# EAGLE design Anti thept2ENGINE -V2 (2) (EAGLE 7.6.0)
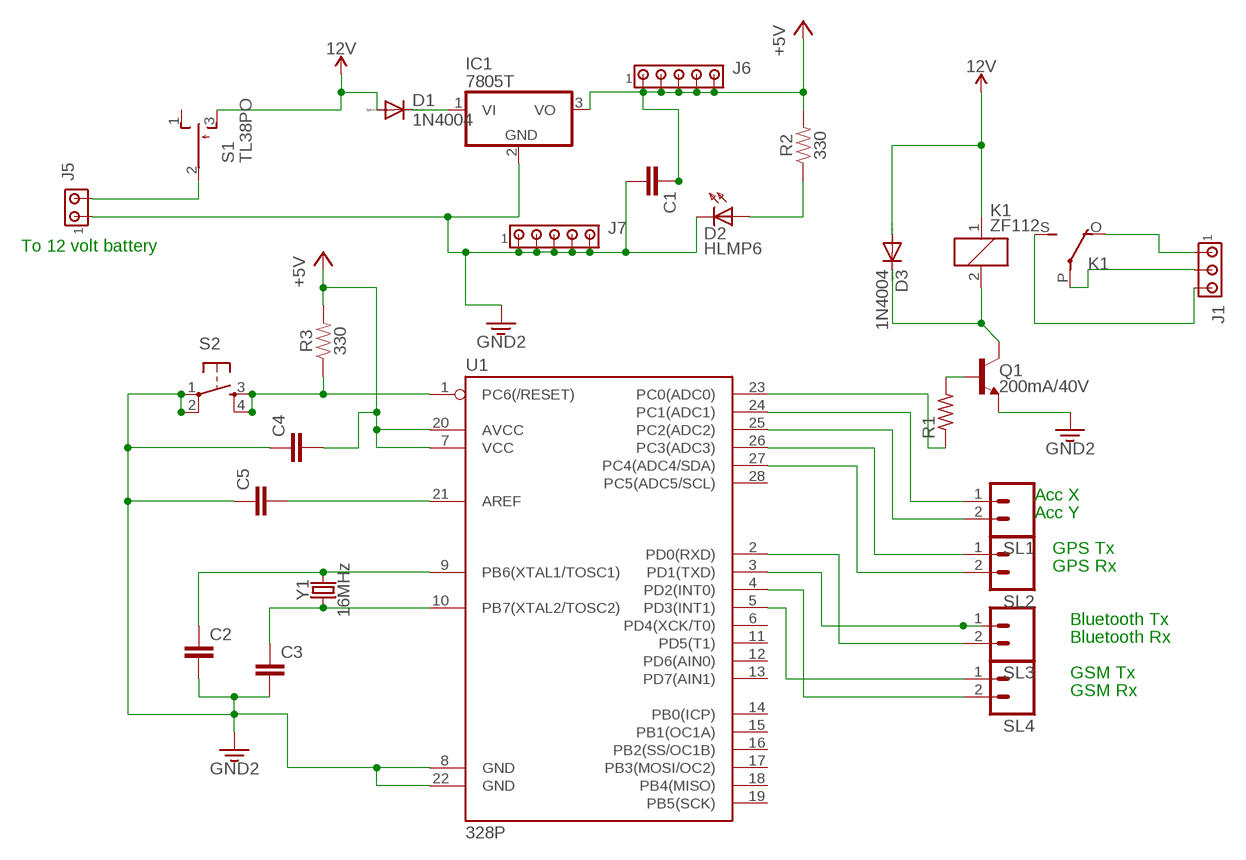
[diagram p0: schematic, sheet 1]

## Parts
C1  C5/2.5  [C5B2.5]
C2  C5/2.5  [C5B2.5]
C3  C5/2.5  [C5B2.5]
C4  C5/2.5  [C5B2.5]
C5  C5/2.5  [C5B2.5]
D1  1N4004  [DO41-10]
D2  HLMP6  [HLMP6]
D3  1N4004  [DO41-10]
IC1  7805T  [TO220H]
J1  MTA03-156  [1X3MTA]
J5  MTA02-156  [1X2MTA]
J6  MTA05-100  [10X05MTA]
J7  MTA05-100  [10X05MTA]
K1  ZF112  [ZF112]
Q1  200mA/40V  TRANS_NPN-2N3904  [TO-92]
R1  R-US_0204/7  [0204/7]
R2  330  330OHM-HORIZ-1/10W-5%  [AXIAL-0.3]
R3  330  330OHM-HORIZ-1/10W-5%  [AXIAL-0.3]
S1  TL38PO  [TL3XPO]
S2  TAC_SWITCHPTH  [TACTILE-PTH]
SL1  MA02  [02PA]
SL2  MA02  [02PA]
SL3  MA02  [02PA]
SL4  MA02  [02PA]
U1  328P  ATMEGA328P_PDIP  [DIP28]
Y1  16MHz  CRYSTAL-16MHZPTH-HC49US  [HC49US]

## Nets
3.3V: C1.2 C2.2 C3.2 C4.1 C5.1 D2.K IC1.2(GND) J5.1 J7.1 J7.2 J7.3 J7.4 J7.5 Q1.1(E) S2.1 S2.2 U1.8(GND) U1.22(GND) ; supply symbol labelled GND2
12V: D1.A D3.A K1.1 S1.3(S)
+5V: C1.1 C4.2 IC1.3(VO) J6.1 J6.2 J6.3 J6.4 J6.5 R2.P$2 R3.P$2 U1.7(VCC) U1.20(AVCC)
N$1: J1.1 K1.O(2:O)
N$2: J1.2 K1.P(2:P)
N$3: Q1.2(B) R1.2
N$4: D3.C K1.2 Q1.3(C)
N$5: J1.3 K1.S(2:S)
N$6: R1.1 U1.23(PC0(ADC0))
N$7: D2.A R2.P$1
N$8: C3.1 U1.10(PB7(XTAL2/TOSC2)) Y1.1
N$9: SL1.1 U1.24(PC1(ADC1))
N$10: R3.P$1 S2.3 S2.4 U1.1(PC6(/RESET))
N$11: SL1.2 U1.25(PC2(ADC2))
N$12: C5.2 U1.21(AREF)
N$13: SL2.1 U1.26(PC3(ADC3))
N$14: J5.2 S1.2(P)
N$15: SL3.2 U1.2(PD0(RXD))
N$16: D1.C IC1.1(VI)
N$17: SL3.1 U1.3(PD1(TXD))
N$18: C2.1 U1.9(PB6(XTAL1/TOSC1)) Y1.2
N$19: SL2.2 U1.27(PC4(ADC4/SDA))
N$20: SL4.2 U1.4(PD2(INT0))
N$21: SL4.1 U1.5(PD3(INT1))
Unconnected: S1.1(O) U1.6(PD4(XCK/T0)) U1.11(PD5(T1)) U1.12(PD6(AIN0)) U1.13(PD7(AIN1)) U1.14(PB0(ICP)) U1.15(PB1(OC1A)) U1.16(PB2(SS/OC1B)) U1.17(PB3(MOSI/OC2)) U1.18(PB4(MISO)) U1.19(PB5(SCK)) U1.28(PC5(ADC5/SCL))

## Notes on the sheet
- To 12 volt battery
- Acc X
- Acc Y
- GPS Tx
- GPS Rx
- Bluetooth Tx
- Bluetooth Rx
- GSM Tx
- GSM Rx

## Library data of the parts
C1-C5 = capacitor-wima:C: CAPACITOR naming: grid - package width
D1 D3 = diode:1N4004: DIODE general purpose rectifier, 1 A
D2 = display-hp:HLMP6: LED 2mm horizontal; MF: AGILENT TECHNOLOGIES; MPN: HLMP-6500; OC_FARNELL: 1652490; OC_NEWARK: 40K0088
IC1 = linear:78*: Positive VOLTAGE REGULATOR Source: http://cache.national.com/ds/LM/LM78L05.pdf http://www.fairchildsemi.com/ds/LM/LM7805.pdf
J1 = con-amp:MTA03-156: AMP connector
J5 = con-amp:MTA02-156: AMP connector
J6 J7 = con-amp:MTA05-100: AMP connector
K1 = relay:ZF112: RELAY 1 x switch; OC_FARNELL: unknown; OC_NEWARK: unknown
Q1 = SparkFun-DiscreteSemi:TRANS_NPN: NPN transistor Current controlled devices typically used to amplify current or used as a switch. BC547 - COM-08928 <http://www.sparkfun.com/products/8928> (TO-92 45V 100mA) (1.Collector 2.Base 3.Emitter) 2N3904 - COM-00521 <http://www.sparkfun.com/products/521> (TO-92 40V 200mA) (1.Emitter 2.Base 3.Collector) P2N2222A - COM-12852 <http://www.sparkfun.com/products/12852> (TO-92 40V 600mA) (1.Collector 2.Base 3.Emitter); PROD_ID: TRANS-08447
R1 = resistor:R-US_: RESISTOR, American symbol
R2 R3 = SparkFun-Resistors:330OHM: 330Ω resistor A resistor is a passive two-terminal electrical component that implements electrical resistance as a circuit element. Resistors act to reduce current flow, and, at the same time, act to lower voltage levels within circuits. - Wikipedia; PROD_ID: RES-8371
S1 = switch:TL38PO: TINY SWITCH ON OFF MOM Source: http://www2.produktinfo.conrad.com/datenblaetter/700000-724999/705152-da-01-de-Subminiaturschalter_TL_36YO.pdf
S2 = SparkFun-Retired:TAC_SWITCH: Momentary Switch Button commonly used for reset or general input. Spark Fun Electronics SKU : COM-00097 SMT- SWCH-08247
SL1-SL4 = con-amp-quick:MA02: AMP QUICK CONNECTOR; OC_FARNELL: unknown; OC_NEWARK: unknown
U1 = SparkFun-IC-Microcontroller:ATMEGA328P_PDIP: Atmel 328P Through hole ATMEGA328P uC used in the Arduino 32kb flash, 1k EEPROM, 2k SRAM Datasheet <http://www.sparkfun.com/datasheets/Components/SMD/ATMega328.pdf> SparkFun Products Storefront component: AVR 28 Pin 20MHz 32K 6A/D - ATMega328P <https://www.sparkfun.com/products/9061> (COM-09061) SparkFun Simon Says - Through-Hole Soldering Kit <https://www.sparkfun.com/products/10547> (KIT-10547) SparkFun Learn to Solder - Simon Says <https://www.sparkfun.com/products/13708> (KIT-13708) SparkFun BigTime Watch Kit <https://www.sparkfun.com/products/11734> (KIT-11734) SparkFun ClockIt <https://www.sparkfun.com/products/10930> (KIT-10930) SparkFun Serial Enabled LCD Kit <https://www.sparkfun.com/products/10097> (LCD-10097) SparkFun Simon Tilts - Through Hole Soldering Kit <https://www.sparkfun.com/products/12634> (KIT-12634) SparkFun Frequency Counter Kit <https://www.sparkfun.com/products/10140> (KIT-10140) FabFM Radio Kit <https://www.sparkfun.com/products/11043> (KIT-11043) SparkFun Binary Blaster Kit <https://www.sparkfun.com/products/12037> (KIT-12037) SparkFun Metro-Gnome <https://www.sparkfun.com/products/9236> (KIT-09236) ATmega328 with Arduino Optiboot (Uno) <https://www.sparkfun.com/products/10524> (DEV-10524); PROD_ID: IC-09136
Y1 = SparkFun-Clocks:CRYSTAL-16MHZ: 16MHz Crystal Digikey Example <http://www.digikey.com/product-search/en?keywords=535-9122-1-ND> Frequency: 16MHz Frequency Stability: ±50ppm Frequency Tolerance: ±20ppm Load Capacitance: 18pF SparkFun Products: Pro Micro -5V/16MHz <https://www.sparkfun.com/products/12640> SparkFun Serial Enabled LCD Kit <https://www.sparkfun.com/products/10097>; PROD_ID: XTAL-08181; SF_ID: COM-00536

## Board
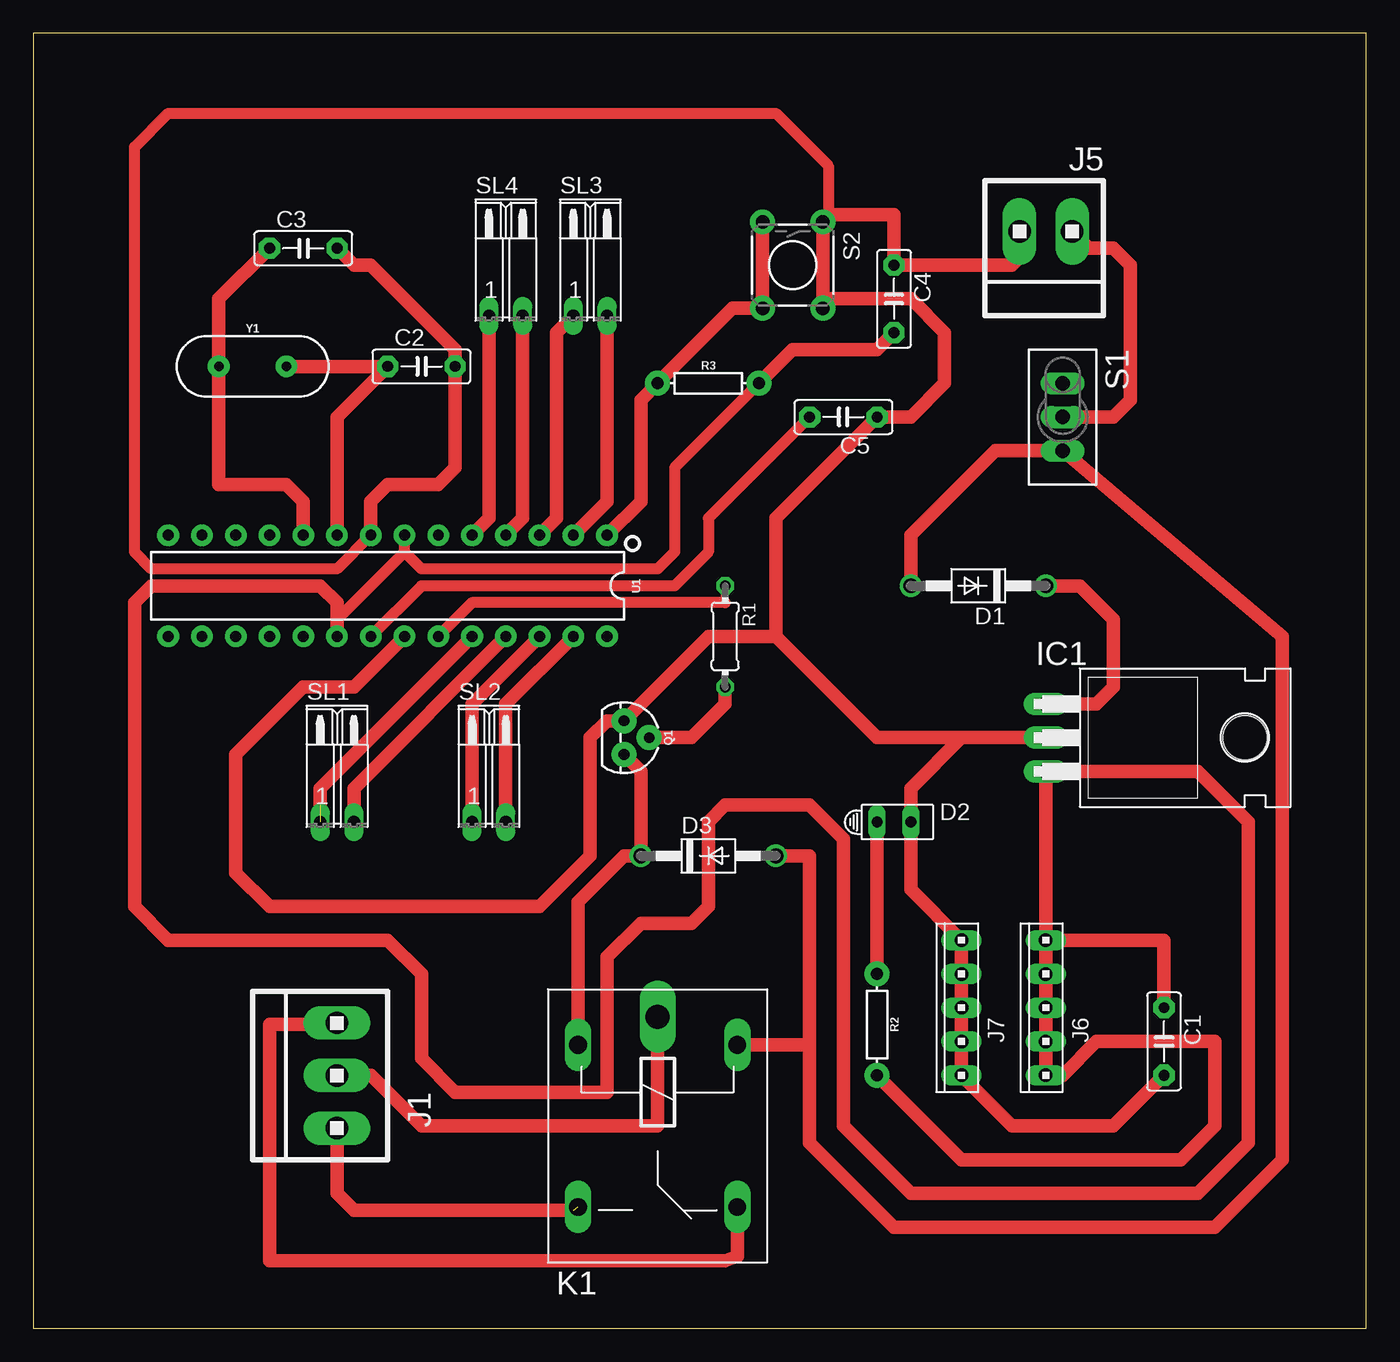
[diagram p1: board, top side]

Size 100.31 x 97.46 mm. Coordinates in mm from the lower left corner, seen from the top.
Outline: 0,0 100.31,0 100.31,97.46 0,97.46 0,0
Copper layers (1*16): Top 0.035mm / dielectric 1.5mm / Bottom 0.035mm
Design rules "default": minimum track width 10mil, minimum drill 24mil, track to track 8mil, track to pad 8mil, pad to pad 8mil, via to via 8mil, smd to smd 8mil, copper to edge 40mil, drill to drill 8mil, minimum pad ring 10mil, minimum via ring 8mil, stop-mask expansion 4mil, vias tented up to drill 0mil, thermal gap 10mil

### Footprints (pad centres in the part's own frame; a part is rotated, then mirrored left to right if it is on the bottom)
C5B2.5 = drill 0.813 pad 1.6 octagon: 1 -2.54,0; 2 2.54,0
DO41-10 = drill 1.118: A 5.08,0; C -5.08,0
HLMP6 = drill 0.813 long: A -1.27,0; K 1.27,0
TO220H = drill 1.118 long: 1 -2.54,-10.16; 2 0,-10.16; 3 2.54,-10.16 | hole 3.302: 0,4.826
1X3MTA = drill 1.676 long: 1 3.937,0; 2 -0.025,0; 3 -3.988,0
1X2MTA = drill 1.676 long: 1 1.981,0; 2 -1.981,0
10X05MTA = drill 1.016 long: 1 5.08,0; 2 2.54,0; 3 0,0; 4 -2.54,0; 5 -5.08,0
ZF112 = drill 1.321 long: 1 -6.096,5.994; 2 -6.096,-5.994; O 6.096,5.994; S 6.096,-5.994 | drill 1.803 long: P -8.204,0
TO-92 = drill 0.813 pad 1.88: 1 -1.27,0; 2 0,1.905; 3 1.27,0
0204/7 = drill 0.813 octagon: 1 -3.81,0; 2 3.81,0
AXIAL-0.3 = drill 0.9 pad 1.88: P$1 -3.81,0; P$2 3.81,0
TL3XPO = drill 1.1 pad 1.422 long: 1 -2.54,0; 2 0,0; 3 2.54,0
TACTILE-PTH = drill 1.016 pad 1.88: 1 -3.251,2.261; 2 3.251,2.261; 3 -3.251,-2.261; 4 3.251,-2.261
02PA = drill 0.914 long: 1 -1.27,0; 2 1.27,0
DIP28 = drill 0.813 pad 1.626: 1 -16.51,-3.81; 2 -13.97,-3.81; 3 -11.43,-3.81; 4 -8.89,-3.81; 5 -6.35,-3.81; 6 -3.81,-3.81; 7 -1.27,-3.81; 8 1.27,-3.81; 9 3.81,-3.81; 10 6.35,-3.81; 11 8.89,-3.81; 12 11.43,-3.81; 13 13.97,-3.81; 14 16.51,-3.81; 15 16.51,3.81; 16 13.97,3.81; 17 11.43,3.81; 18 8.89,3.81; 19 6.35,3.81; 20 3.81,3.81; 21 1.27,3.81; 22 -1.27,3.81; 23 -3.81,3.81; 24 -6.35,3.81; 25 -8.89,3.81; 26 -11.43,3.81; 27 -13.97,3.81; 28 -16.51,3.81
HC49US = drill 0.7 pad 1.651: 1 -2.54,0; 2 2.54,0

### Placement (x,y rotation side)
C1  85.09,21.59 270 top
C2  29.21,72.39 0 top
C3  20.32,81.28 0 top
C4  64.77,77.47 270 top
C5  60.96,68.58 180 top
D1  71.12,55.88 180 top
D2  64.77,38.1 0 top
D3  50.8,35.56 0 top
IC1  86.36,44.45 270 top
J1  22.86,19.05 90 top
J5  76.2,82.55 180 top
J6  76.2,24.13 90 top
J7  69.85,24.13 90 top
K1  46.99,15.24 270 top
Q1  44.45,44.45 270 top
R1  52.07,52.07 270 top
R2  63.5,22.86 270 top
R3  50.8,71.12 0 top
S1  77.47,68.58 270 top
S2  57.15,80.01 270 top
SL1  22.86,38.1 0 top
SL2  34.29,38.1 0 top
SL3  41.91,76.2 0 top
SL4  35.56,76.2 0 top
U1  26.67,55.88 180 top
Y1  16.51,72.39 0 top

### Tracks (layer width: path | path; a pad name or v marks a point on that pad's centre or on a via)
3.3V
  Top 0.813: U1.8 22.86,57.15 8.89,57.15 7.62,58.42 7.62,88.9 10.16,91.44 55.88,91.44 59.83,87.49 59.83,83.68
  Top 1.016: C1.2 81.28,15.24 73.66,15.24 J7.5 J7.4 J7.3 J7.2 J7.1 66.04,33.02 D2.K 66.04,40.64 69.85,44.45 IC1.2 63.5,44.45 55.88,52.07 | C3.2 24.13,80.01 25.4,80.01 31.75,73.66 C2.2 31.75,64.77 30.48,63.5 26.67,63.5 25.4,62.23 U1.8 | J5.1 74.22,80.57 73.66,80.01 C4.1 64.77,83.82 59.97,83.82 59.83,83.68 S2.1 S2.2 60.12,77.47 66.04,77.47 68.58,74.93 68.58,71.12 66.04,68.58 C5.1 55.88,60.96 55.88,52.07 | 55.88,52.07 50.8,52.07 Q1.1 43.18,45.72 41.91,44.45 41.91,35.56 38.1,31.75 17.78,31.75 15.24,34.29 15.24,43.18 20.32,48.26 24.13,48.26 U1.22
12V
  Top 1.016: D1.A 66.04,59.69 72.39,66.04 S1.3 93.98,52.07 93.98,12.7 88.9,7.62 64.77,7.62 58.42,13.97 58.42,21.59 | 58.42,21.59 58.17,21.34 K1.1 | D3.A 58.42,35.56 58.42,21.59
+5V
  Top 0.813: R3.P$2 48.26,64.77 48.26,58.42 46.99,57.15 29.21,57.15 27.94,58.42 | 27.94,58.42 U1.7 | 27.94,58.42 22.86,53.34 U1.20
  Top 1.016: J6.1 IC1.3 87.63,41.91 91.44,38.1 91.44,13.97 87.63,10.16 66.04,10.16 60.96,15.24 60.96,36.83 58.42,39.37 52.07,39.37 50.8,38.1 50.8,31.75 49.53,30.48 45.72,30.48 43.18,27.94 43.18,17.78 31.75,17.78 29.21,20.32 29.21,26.67 26.67,29.21 10.16,29.21 7.62,31.75 7.62,54.61 8.89,55.88 21.59,55.88 22.86,54.61 U1.20 | C1.1 85.09,29.21 J6.1 | R2.P$2 69.85,12.7 86.36,12.7 88.9,15.24 88.9,21.59 80.01,21.59 77.47,19.05 J6.5 J6.4 J6.3 J6.2 J6.1 | R3.P$2 57.15,73.66 63.5,73.66 C4.2
N$1
  Top 1.016: J1.1 22.73,22.86 17.78,22.86 17.78,5.08 52.07,5.08 52.98,5.44 K1.O
N$2
  Top 1.016: K1.P 46.99,15.24 29.21,15.24 25.42,19.02 J1.2
N$3
  Top 0.406: 45.72,44.45 Q1.2
  Top 1.016: Q1.2 49.53,44.45 52.07,46.99 R1.2
N$4
  Top 1.016: Q1.3 45.72,41.91 D3.C 44.45,35.56 41,32.11 K1.2 40.64,21.69
N$5  (1 unrouted)
  Top 1.016: J1.3 22.86,10.16 24.13,8.89 40.64,8.89
N$6
  Top 0.61: 52.07,54.61 R1.1
  Top 0.813: 52.07,54.61 33.02,54.61 U1.23
N$7
  Top 1.016: R2.P$1 D2.A
N$8
  Top 1.016: C3.1 13.97,77.47 Y1.1 13.97,63.5 19.05,63.5 20.32,62.23 U1.10
N$9  (1 unrouted)
  Top 1.016: U1.24 21.59,40.64 21.59,39.37
N$10
  Top 1.016: U1.1 45.72,62.23 45.72,69.85 R3.P$1 52.63,76.76 S2.4 S2.3
N$11
  Top 1.016: U1.25 24.13,40.64 SL1.2
N$12
  Top 0.813: C5.2 50.8,60.96 50.8,58.42 48.26,55.88 29.21,55.88 U1.21
N$13
  Top 1.016: U1.26 33.02,46.99 SL2.1
N$14
  Top 1.016: J5.2 79.45,81.28 81.28,81.28 82.55,80.01 82.55,69.85 81.28,68.58 S1.2
N$15
  Top 1.016: SL3.2 43.18,62.23 U1.2
N$16
  Top 1.016: D1.C 78.74,55.88 81.28,53.34 81.28,48.26 80.01,46.99 IC1.1
N$17
  Top 1.016: SL3.1 39.37,74.93 39.37,60.96 U1.3
N$18
  Top 1.016: Y1.2 C2.1 22.86,68.58 U1.9
N$19
  Top 1.016: U1.27 35.56,46.99 SL2.2
N$20
  Top 1.016: SL4.2 36.83,60.96 U1.4
N$21
  Top 1.016: SL4.1 34.29,60.96 U1.5